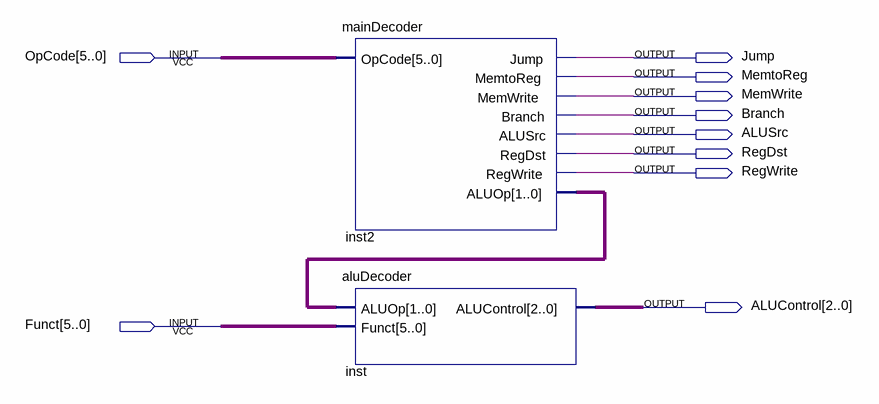
[diagram p0: schematic sheet]
// Quartus schematic controlUnit.bdf as structural Verilog: 2 symbols, 10 pins
module controlUnit (
  input  [5:0] OpCode,
  input  [5:0] Funct,
  output Jump,
  output MemtoReg,
  output MemWrite,
  output Branch,
  output ALUSrc,
  output RegDst,
  output RegWrite,
  output [2:0] ALUControl
);

  wire [1:0] inst2_aluop;

  mainDecoder inst2 (
    .OpCode(OpCode), .Jump(Jump), .MemtoReg(MemtoReg), .MemWrite(MemWrite), .Branch(Branch), .ALUSrc(ALUSrc),
    .RegDst(RegDst), .RegWrite(RegWrite), .ALUOp(inst2_aluop));
  aluDecoder inst (.ALUOp(inst2_aluop), .Funct(Funct), .ALUControl(ALUControl));
endmodule
